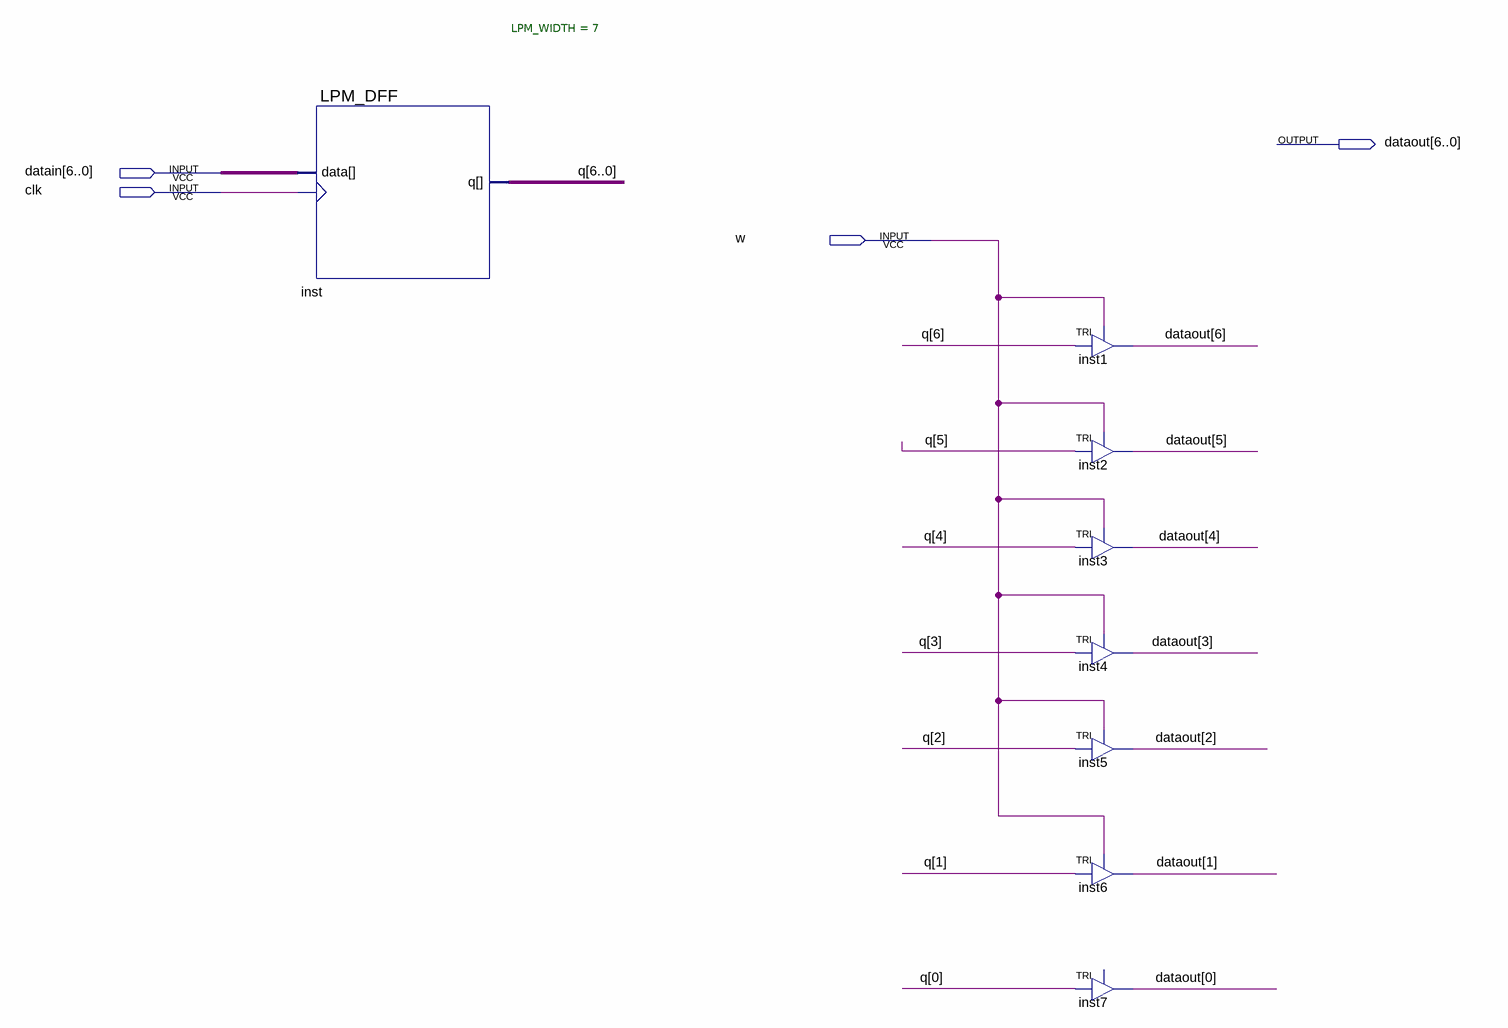
[diagram p0: schematic sheet]
// Quartus schematic reg7seg.bdf as structural Verilog: 8 symbols, 4 pins
module reg7seg (
  input  [6:0] datain,
  input  clk,
  input  w,
  output [6:0] dataout
);

  wire [6:0] q;

  LPM_DFF #(.LPM_WIDTH(7)) inst (.clock(clk), .data(datain), .q(q));
  TRI inst1 (.IN(q[6]), .OE(w), .OUT(dataout[6]));
  TRI inst2 (.IN(q[5]), .OE(w), .OUT(dataout[5]));
  TRI inst3 (.IN(q[4]), .OE(w), .OUT(dataout[4]));
  TRI inst4 (.IN(q[3]), .OE(w), .OUT(dataout[3]));
  TRI inst5 (.IN(q[2]), .OE(w), .OUT(dataout[2]));
  TRI inst6 (.IN(q[1]), .OE(w), .OUT(dataout[1]));
  TRI inst7 (.IN(q[0]), .OUT(dataout[0]));  // open: OE
endmodule
